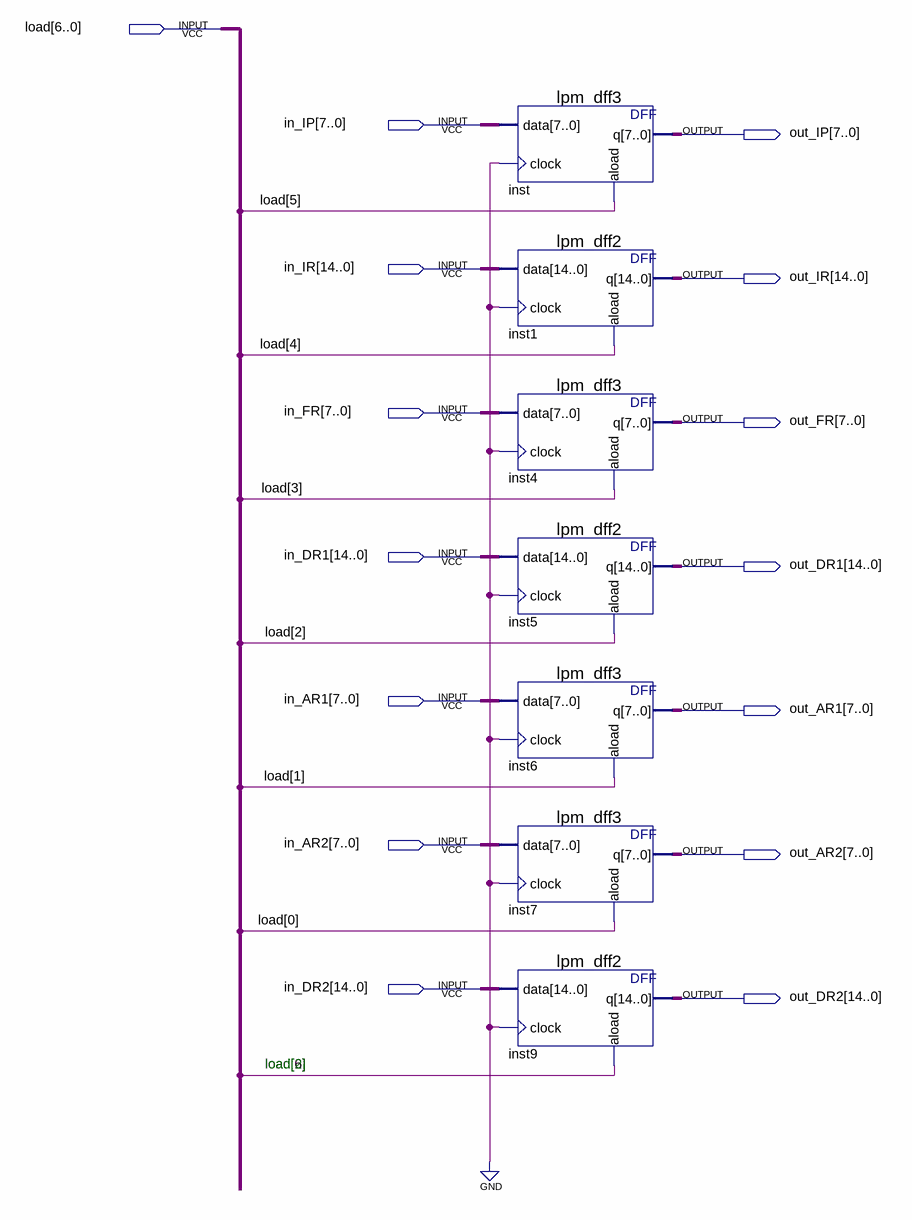
[diagram p0: schematic sheet]
// Quartus schematic SReg.bdf as structural Verilog: 7 symbols, 15 pins
module SReg (
  input  [6:0] load,
  input  [7:0] in_IP,
  input  [14:0] in_IR,
  input  [7:0] in_FR,
  input  [14:0] in_DR1,
  input  [7:0] in_AR1,
  input  [7:0] in_AR2,
  input  [14:0] in_DR2,
  output [7:0] out_IP,
  output [14:0] out_IR,
  output [7:0] out_FR,
  output [14:0] out_DR1,
  output [7:0] out_AR1,
  output [7:0] out_AR2,
  output [14:0] out_DR2
);

  lpm_dff3 inst (.data(in_IP), .clock(1'b0), .aload(load[5]), .q(out_IP));
  lpm_dff2 inst1 (.data(in_IR), .clock(1'b0), .aload(load[4]), .q(out_IR));
  lpm_dff3 inst4 (.data(in_FR), .clock(1'b0), .aload(load[3]), .q(out_FR));
  lpm_dff2 inst5 (.data(in_DR1), .clock(1'b0), .aload(load[2]), .q(out_DR1));
  lpm_dff3 inst6 (.data(in_AR1), .clock(1'b0), .aload(load[1]), .q(out_AR1));
  lpm_dff3 inst7 (.data(in_AR2), .clock(1'b0), .aload(load[0]), .q(out_AR2));
  lpm_dff2 inst9 (.data(in_DR2), .clock(1'b0), .aload(load[6]), .q(out_DR2));

  // Notes on the sheet:
  //   load[2]
endmodule
